# Altium schematic sheet Level Shifter (PCA9306JKZ).SchDoc
size A; SheetNumber: 8; SheetTotal: 9
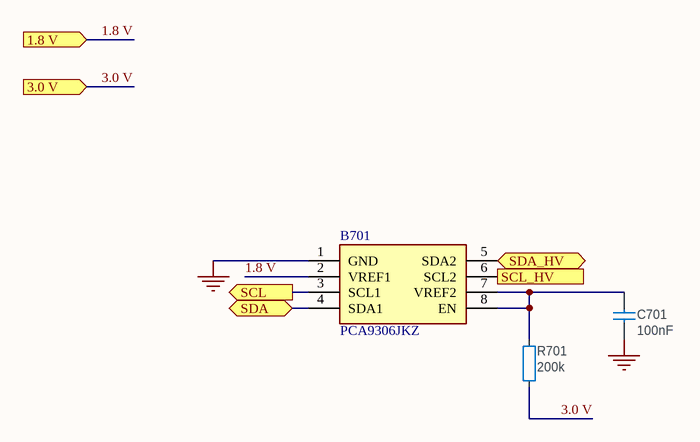
[diagram p0: Level Shifter (PCA9306JKZ).SchDoc]

## Parts
B701  PCA9306JKZ  [PCA9306JKZ]
C701  100nF  [CAPC0603X03L_C]
R701  200k  [RESC0603X03L_C]

## Ports
1.8 V (in, see Digital_Watch[3C], IMU (BMI270)[1A], PMIC (nPM1300)[3B], PPG (MAX30102)[1A]), 3.0 V (in, see Digital_Watch[3C], GNNS (SAM-M10Q-00B)[1A], MCU (nrf5340)[2A], PMIC (nPM1300)[3B]), SCL (out, see Digital_Watch[3C], IMU (BMI270)[1A], MCU (nrf5340)[4C], PMIC (nPM1300)[2C], PPG (MAX30102)[1A]), SCL_HV (out, see Digital_Watch[3C], GNNS (SAM-M10Q-00B)[1A]), SDA (bidir, see Digital_Watch[3C], IMU (BMI270)[1B], MCU (nrf5340)[4C], PMIC (nPM1300)[2C], PPG (MAX30102)[1A]), SDA_HV (bidir, see Digital_Watch[3C], GNNS (SAM-M10Q-00B)[1A])

## Nets
GND: B701.1(GND) C701.1
1.8 V: B701.2(VREF1) ; port 1.8 V
3.0 V: R701.1 ; port 3.0 V
SCL: B701.3(SCL1) ; port SCL
SCL_HV: B701.6(SCL2) ; port SCL_HV
SDA: B701.4(SDA1) ; port SDA
SDA_HV: B701.5(SDA2) ; port SDA_HV
NetB701_7: B701.7(VREF2) B701.8(EN) C701.2 R701.2

## Library data of the parts
B701 = PCA9306JKZ: Dual Supply bidirectional I2C-bus and SMBus voltage-level translator; Manufacturer: NXP Semiconductors; Max Supply Voltage: 3.6V; Min Supply Voltage: 0V; Nominal Supply Voltage (DC): 1.2V; Number of Bits: 1; Propagation Delay: 3.3ns; Supplier: Arrow Electronics; Supplier Part Number: PCA9306JKZ; Manufacturer Part Number: PCA9306JKZ; RoHS: Compliant; Category: Voltage Level Shifters; Stock: 18000; Pricing: 6000=0.3053, 12000=0.2988, 18000=0.2948 (USD); China RoHS: Compliant; Height - Seated (Max): 500µm; Length: 1.35mm; Lifecycle Status: Production; Max Operating Temperature: 105°C; Min Operating Temperature: -40°C; Number of Circuits: 1; Number of Terminals: 8; REACH SVHC: Yes; Terminal Pitch: 350µm; Width: 1mm; ComponentLink1URL: https://datasheet.octopart.com:443/PCA9306JKZ-NXP-Semiconductors-datasheet-180940845.pdf?src-supplier=IHS; ComponentLink1Description: https://datasheet.octopart.com:443/PCA9306JKZ-NXP-Semiconductors-datasheet-180940845.pdf?src-supplier=IHS; ComponentLink2URL: https://datasheet.octopart.com:443/PCA9306JKZ-NXP-Semiconductors-datasheet-24570114.pdf?src-supplier=Future+Electronics; ComponentLink2Description: https://datasheet.octopart.com:443/PCA9306JKZ-NXP-Semiconductors-datasheet-24570114.pdf?src-supplier=Future+Electronics; ComponentLink3URL: http://sigma.octopart.com:80/reach_statement/NXP-Semiconductors-company-13.pdf?src-supplier=Compliance+Statements; ComponentLink3Description: http://sigma.octopart.com:80/reach_statement/NXP-Semiconductors-company-13.pdf?src-supplier=Compliance+Statements; ComponentLink4URL: http://sigma.octopart.com:80/rohs_statement/NXP-Semiconductors-company-12.pdf?src-supplier=Compliance+Statements; ComponentLink4Description: http://sigma.octopart.com:80/rohs_statement/NXP-Semiconductors-company-12.pdf?src-supplier=Compliance+Statements; Supplier 1: DigiKey; Supplier Part Number 1: 568-PCA9306JKZCT-ND
C701 = C0201-100n-16V-X7S: Capacitor, X7S, ±10%; Pad Count: 2; Value: 100nF; Footprint Doc: 0201; Component Class: Capacitors; Author: rsk
R701 = R0201: Resistor, ±1%, 0.05W; Pad Count: 2; Footprint Doc: 0201; Value: 200k; Component Class: Resistors; Author: rsk